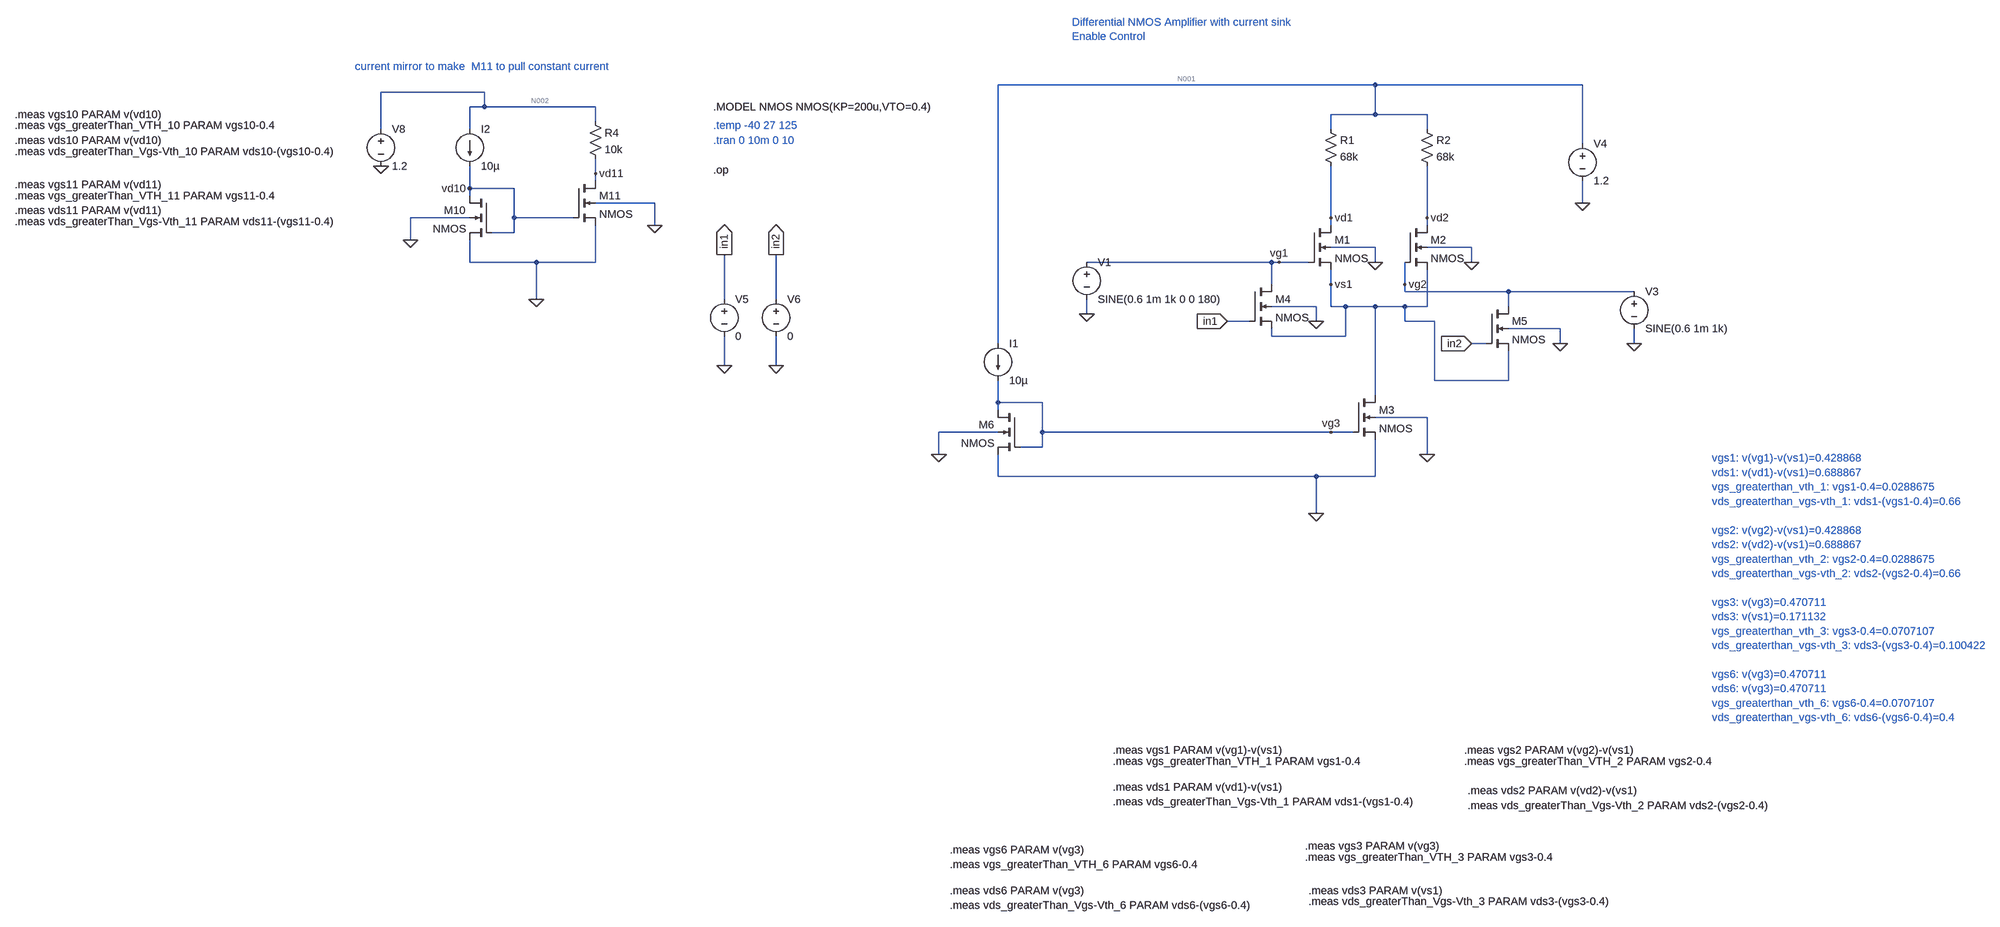
[diagram p0: schematic 4_differential_amplifier_with_current_mirror_without_lambda.asc]
4_differential_amplifier_with_current_mirror_without_lambda.asc, the LTspice schematic file:
Version 4
SHEET 1 1752 1748
WIRE 368 -432 -448 -432
WIRE 816 -432 368 -432
WIRE -1712 -416 -1936 -416
WIRE -1712 -384 -1712 -416
WIRE -1712 -384 -1744 -384
WIRE -1472 -384 -1712 -384
WIRE 368 -368 368 -432
WIRE 368 -368 272 -368
WIRE 480 -368 368 -368
WIRE -1472 -352 -1472 -384
WIRE -1936 -336 -1936 -416
WIRE -1744 -336 -1744 -384
WIRE 272 -336 272 -368
WIRE 480 -336 480 -368
WIRE 816 -304 816 -432
WIRE -1472 -240 -1472 -272
WIRE -1472 -224 -1472 -240
WIRE -1744 -208 -1744 -256
WIRE -1648 -208 -1744 -208
WIRE -1744 -192 -1744 -208
WIRE -1344 -176 -1472 -176
WIRE 816 -176 816 -224
WIRE -1744 -144 -1872 -144
WIRE -1648 -144 -1648 -208
WIRE -1520 -144 -1648 -144
WIRE 272 -144 272 -256
WIRE 480 -144 480 -256
WIRE -1344 -128 -1344 -176
WIRE 272 -128 272 -144
WIRE 480 -128 480 -144
WIRE -1648 -112 -1648 -144
WIRE -1648 -112 -1696 -112
WIRE -1872 -96 -1872 -144
WIRE 368 -80 272 -80
WIRE 576 -80 480 -80
WIRE -1744 -48 -1744 -96
WIRE -1600 -48 -1744 -48
WIRE -1472 -48 -1472 -128
WIRE -1472 -48 -1600 -48
WIRE 144 -48 -256 -48
WIRE 160 -48 144 -48
WIRE 224 -48 160 -48
WIRE 368 -48 368 -80
WIRE 576 -48 576 -80
WIRE 144 0 144 -48
WIRE 272 0 272 -32
WIRE 432 0 432 -48
WIRE 432 16 432 0
WIRE 656 16 432 16
WIRE 928 16 656 16
WIRE -1600 32 -1600 -48
WIRE -1040 32 -1040 -64
WIRE -928 32 -928 -64
WIRE 240 48 144 48
WIRE 272 48 272 0
WIRE 304 48 272 48
WIRE 368 48 304 48
WIRE 432 48 368 48
WIRE 480 48 480 -32
WIRE 480 48 432 48
WIRE 656 48 656 16
WIRE -256 64 -256 32
WIRE 96 80 48 80
WIRE 240 80 240 48
WIRE 432 80 432 48
WIRE 496 80 432 80
WIRE 768 96 656 96
WIRE 144 112 144 96
WIRE 304 112 304 48
WIRE 304 112 144 112
WIRE -448 128 -448 -432
WIRE 608 128 576 128
WIRE 768 128 768 96
WIRE 928 128 928 96
WIRE -1040 176 -1040 112
WIRE -928 176 -928 112
WIRE 496 208 496 80
WIRE 656 208 656 144
WIRE 656 208 496 208
WIRE 368 240 368 48
WIRE -448 256 -448 208
WIRE -352 256 -448 256
WIRE -448 272 -448 256
WIRE 480 288 368 288
WIRE -448 320 -576 320
WIRE -352 320 -352 256
WIRE 272 320 -352 320
WIRE 320 320 272 320
WIRE -352 352 -352 320
WIRE -352 352 -400 352
WIRE -576 368 -576 320
WIRE 480 368 480 288
WIRE -448 416 -448 368
WIRE 240 416 -448 416
WIRE 368 416 368 336
WIRE 368 416 240 416
WIRE 240 496 240 416
FLAG -256 64 0
FLAG 368 -48 0
FLAG 576 -48 0
FLAG 928 128 0
FLAG 816 -176 0
FLAG 160 -48 vg1
FLAG 272 0 vs1
FLAG 272 -144 vd1
FLAG 432 0 vg2
FLAG 480 -144 vd2
FLAG 272 320 vg3
FLAG -1040 176 0
FLAG -928 176 0
FLAG -1040 -64 in1
IOPIN -1040 -64 Out
FLAG -928 -64 in2
IOPIN -928 -64 Out
FLAG 768 128 0
FLAG 240 80 0
FLAG 48 80 in1
IOPIN 48 80 In
FLAG 576 128 in2
IOPIN 576 128 In
FLAG -1872 -96 0
FLAG -1344 -128 0
FLAG -1936 -256 0
FLAG -1600 32 0
FLAG -1744 -208 vd10
FLAG -1472 -240 vd11
FLAG -576 368 0
FLAG 240 496 0
FLAG 480 368 0
SYMBOL nmos4 224 -128 R0
SYMATTR InstName M1
SYMATTR Value2 l=1u w=60u
SYMBOL nmos4 432 -128 R0
SYMATTR InstName M2
SYMATTR Value2 l=1u w=60u
SYMBOL nmos4 320 240 R0
SYMATTR InstName M3
SYMATTR Value2 l=1u w=20u
SYMBOL voltage -256 -64 R0
WINDOW 123 0 0 Left 0
WINDOW 39 0 0 Left 0
SYMATTR InstName V1
SYMATTR Value SINE(0.6 1m 1k 0 0 180)
SYMBOL voltage 928 0 R0
WINDOW 123 0 0 Left 0
WINDOW 39 0 0 Left 0
SYMATTR InstName V3
SYMATTR Value SINE(0.6 1m 1k)
SYMBOL voltage 816 -320 R0
WINDOW 123 0 0 Left 0
WINDOW 39 0 0 Left 0
SYMATTR InstName V4
SYMATTR Value 1.2
SYMBOL res 256 -352 R0
SYMATTR InstName R1
SYMATTR Value 68k
SYMBOL res 464 -352 R0
SYMATTR InstName R2
SYMATTR Value 68k
SYMBOL voltage -1040 16 R0
WINDOW 123 0 0 Left 0
WINDOW 39 0 0 Left 0
SYMATTR InstName V5
SYMATTR Value 0
SYMBOL voltage -928 16 R0
WINDOW 123 0 0 Left 0
WINDOW 39 0 0 Left 0
SYMATTR InstName V6
SYMATTR Value 0
SYMBOL nmos4 96 0 R0
SYMATTR InstName M4
SYMATTR Value2 l=1u w=60u
SYMBOL nmos4 608 48 R0
SYMATTR InstName M5
SYMATTR Value2 l=1u w=60u
SYMBOL current -1744 -336 R0
WINDOW 123 0 0 Left 0
WINDOW 39 0 0 Left 0
SYMATTR InstName I2
SYMATTR Value 10µ
SYMBOL res -1488 -368 R0
SYMATTR InstName R4
SYMATTR Value 10k
SYMBOL nmos4 -1696 -192 M0
SYMATTR InstName M10
SYMATTR Value2 l=1u w=60u
SYMBOL nmos4 -1520 -224 R0
SYMATTR InstName M11
SYMATTR Value2 l=1u w=60u
SYMBOL voltage -1936 -352 R0
WINDOW 123 0 0 Left 0
WINDOW 39 0 0 Left 0
SYMATTR InstName V8
SYMATTR Value 1.2
SYMBOL current -448 128 R0
WINDOW 123 0 0 Left 0
WINDOW 39 0 0 Left 0
SYMATTR InstName I1
SYMATTR Value 10µ
SYMBOL nmos4 -400 272 M0
SYMATTR InstName M6
SYMATTR Value2 l=1u w=20u
TEXT -288 -568 Left 2 ;Differential NMOS Amplifier with current sink\nEnable Control
TEXT -1064 -384 Left 2 !.MODEL NMOS NMOS(KP=200u,VTO=0.4)
TEXT -1064 -312 Left 2 ;.tran 0 10m 0 10
TEXT -200 1008 Left 2 !.meas vgs1 PARAM v(vg1)-v(vs1)
TEXT -200 1088 Left 2 !.meas vds1 PARAM v(vd1)-v(vs1)
TEXT -200 1032 Left 2 !.meas vgs_greaterThan_VTH_1 PARAM vgs1-0.4
TEXT -200 1120 Left 2 !.meas vds_greaterThan_Vgs-Vth_1 PARAM vds1-(vgs1-0.4)
TEXT 560 1008 Left 2 !.meas vgs2 PARAM v(vg2)-v(vs1)
TEXT 568 1096 Left 2 !.meas vds2 PARAM v(vd2)-v(vs1)
TEXT 560 1032 Left 2 !.meas vgs_greaterThan_VTH_2 PARAM vgs2-0.4
TEXT 568 1128 Left 2 !.meas vds_greaterThan_Vgs-Vth_2 PARAM vds2-(vgs2-0.4)
TEXT 216 1216 Left 2 !.meas vgs3 PARAM v(vg3)
TEXT 224 1312 Left 2 !.meas vds3 PARAM v(vs1)
TEXT 216 1240 Left 2 !.meas vgs_greaterThan_VTH_3 PARAM vgs3-0.4
TEXT 224 1336 Left 2 !.meas vds_greaterThan_Vgs-Vth_3 PARAM vds3-(vgs3-0.4)
TEXT -1064 -248 Left 2 !.op
TEXT -1064 -344 Left 2 ;.temp -40 27 125
TEXT -2728 -368 Left 2 !.meas vgs10 PARAM v(vd10)
TEXT -2728 -312 Left 2 !.meas vds10 PARAM v(vd10)
TEXT -2728 -344 Left 2 !.meas vgs_greaterThan_VTH_10 PARAM vgs10-0.4
TEXT -2728 -288 Left 2 !.meas vds_greaterThan_Vgs-Vth_10 PARAM vds10-(vgs10-0.4)
TEXT -2728 -216 Left 2 !.meas vgs11 PARAM v(vd11)
TEXT -2728 -160 Left 2 !.meas vds11 PARAM v(vd11)
TEXT -2728 -192 Left 2 !.meas vgs_greaterThan_VTH_11 PARAM vgs11-0.4
TEXT -2728 -136 Left 2 !.meas vds_greaterThan_Vgs-Vth_11 PARAM vds11-(vgs11-0.4)
TEXT -1992 -472 Left 2 ;current mirror to make  M11 to pull constant current
TEXT -552 1224 Left 2 !.meas vgs6 PARAM v(vg3)
TEXT -552 1312 Left 2 !.meas vds6 PARAM v(vg3)
TEXT -552 1256 Left 2 !.meas vgs_greaterThan_VTH_6 PARAM vgs6-0.4
TEXT -552 1344 Left 2 !.meas vds_greaterThan_Vgs-Vth_6 PARAM vds6-(vgs6-0.4)
TEXT 1096 376 Left 2 ;vgs1: v(vg1)-v(vs1)=0.428868\nvds1: v(vd1)-v(vs1)=0.688867\nvgs_greaterthan_vth_1: vgs1-0.4=0.0288675\nvds_greaterthan_vgs-vth_1: vds1-(vgs1-0.4)=0.66\n \nvgs2: v(vg2)-v(vs1)=0.428868\nvds2: v(vd2)-v(vs1)=0.688867\nvgs_greaterthan_vth_2: vgs2-0.4=0.0288675\nvds_greaterthan_vgs-vth_2: vds2-(vgs2-0.4)=0.66\n \nvgs3: v(vg3)=0.470711\nvds3: v(vs1)=0.171132\nvgs_greaterthan_vth_3: vgs3-0.4=0.0707107\nvds_greaterthan_vgs-vth_3: vds3-(vgs3-0.4)=0.100422\n \nvgs6: v(vg3)=0.470711\nvds6: v(vg3)=0.470711\nvgs_greaterthan_vth_6: vgs6-0.4=0.0707107\nvds_greaterthan_vgs-vth_6: vds6-(vgs6-0.4)=0.4

The netlist it stands for:
* 4_differential_amplifier_with_current_mirror_without_lambda.asc
M1 vd1 vg1 vs1 0 NMOS l=1u w=60u
M2 vd2 vg2 vs1 0 NMOS l=1u w=60u
M3 vs1 vg3 0 0 NMOS l=1u w=20u
V1 vg1 0 SINE(0.6 1m 1k 0 0 180)
V3 vg2 0 SINE(0.6 1m 1k)
V4 N001 0 1.2
R1 N001 vd1 68k
R2 N001 vd2 68k
V5 in1 0 0
V6 in2 0 0
M4 vg1 in1 vs1 0 NMOS l=1u w=60u
M5 vg2 in2 vs1 0 NMOS l=1u w=60u
I2 N002 vd10 10µ
R4 N002 vd11 10k
M10 vd10 vd10 0 0 NMOS l=1u w=60u
M11 vd11 vd10 0 0 NMOS l=1u w=60u
V8 N002 0 1.2
I1 N001 vg3 10µ
M6 vg3 vg3 0 0 NMOS l=1u w=20u
.model NMOS NMOS
.model PMOS PMOS
.lib standard.mos
* Differential NMOS Amplifier with current sink
* Enable Control
.MODEL NMOS NMOS(KP=200u,VTO=0.4)
* .tran 0 10m 0 10
.meas vgs1 PARAM v(vg1)-v(vs1)
.meas vds1 PARAM v(vd1)-v(vs1)
.meas vgs_greaterThan_VTH_1 PARAM vgs1-0.4
.meas vds_greaterThan_Vgs-Vth_1 PARAM vds1-(vgs1-0.4)
.meas vgs2 PARAM v(vg2)-v(vs1)
.meas vds2 PARAM v(vd2)-v(vs1)
.meas vgs_greaterThan_VTH_2 PARAM vgs2-0.4
.meas vds_greaterThan_Vgs-Vth_2 PARAM vds2-(vgs2-0.4)
.meas vgs3 PARAM v(vg3)
.meas vds3 PARAM v(vs1)
.meas vgs_greaterThan_VTH_3 PARAM vgs3-0.4
.meas vds_greaterThan_Vgs-Vth_3 PARAM vds3-(vgs3-0.4)
.op
* .temp -40 27 125
.meas vgs10 PARAM v(vd10)
.meas vds10 PARAM v(vd10)
.meas vgs_greaterThan_VTH_10 PARAM vgs10-0.4
.meas vds_greaterThan_Vgs-Vth_10 PARAM vds10-(vgs10-0.4)
.meas vgs11 PARAM v(vd11)
.meas vds11 PARAM v(vd11)
.meas vgs_greaterThan_VTH_11 PARAM vgs11-0.4
.meas vds_greaterThan_Vgs-Vth_11 PARAM vds11-(vgs11-0.4)
* current mirror to make  M11 to pull constant current
.meas vgs6 PARAM v(vg3)
.meas vds6 PARAM v(vg3)
.meas vgs_greaterThan_VTH_6 PARAM vgs6-0.4
.meas vds_greaterThan_Vgs-Vth_6 PARAM vds6-(vgs6-0.4)
* vgs1: v(vg1)-v(vs1)=0.428868
* vds1: v(vd1)-v(vs1)=0.688867
* vgs_greaterthan_vth_1: vgs1-0.4=0.0288675
* vds_greaterthan_vgs-vth_1: vds1-(vgs1-0.4)=0.66
* vgs2: v(vg2)-v(vs1)=0.428868
* vds2: v(vd2)-v(vs1)=0.688867
* vgs_greaterthan_vth_2: vgs2-0.4=0.0288675
* vds_greaterthan_vgs-vth_2: vds2-(vgs2-0.4)=0.66
* vgs3: v(vg3)=0.470711
* vds3: v(vs1)=0.171132
* vgs_greaterthan_vth_3: vgs3-0.4=0.0707107
* vds_greaterthan_vgs-vth_3: vds3-(vgs3-0.4)=0.100422
* vgs6: v(vg3)=0.470711
* vds6: v(vg3)=0.470711
* vgs_greaterthan_vth_6: vgs6-0.4=0.0707107
* vds_greaterthan_vgs-vth_6: vds6-(vgs6-0.4)=0.4
.backanno
.end

* Results of the author's LTspice run, read from the files saved beside the schematic
* Operating Point:
*   V(vd1) = 860 mV
*   V(vg1) = 600 mV
*   V(vs1) = 171.1 mV
*   V(vd2) = 860 mV
*   V(vg2) = 600 mV
*   V(vg3) = 470.7 mV
*   V(n001) = 1.2 V
*   V(in1) = 0 V
*   V(in2) = 0 V
*   V(n002) = 1.2 V
*   V(vd10) = 440.8 mV
*   V(vd11) = 1.1 V
*   Id(M6) = 10 µA
*   Ig(M6) = 0 A
*   Ib(M6) = -480.7 fA
*   Is(M6) = -10 µA
*   Id(M11) = 10 µA
*   Ig(M11) = 0 A
*   Ib(M11) = -1.11 pA
*   Is(M11) = -10 µA
*   Id(M10) = 10 µA
*   Ig(M10) = 0 A
*   Ib(M10) = -450.8 fA
*   Is(M10) = -10 µA
*   Id(M5) = 1.039 pA
*   Ig(M5) = 0 A
*   Ib(M5) = -791.1 fA
*   Is(M5) = -247.7 fA
*   Id(M4) = 1.039 pA
*   Ig(M4) = 0 A
*   Ib(M4) = -791.1 fA
*   Is(M4) = -247.7 fA
*   Id(M3) = 10 µA
*   Ig(M3) = 0 A
*   Ib(M3) = -181.1 fA
*   Is(M3) = -10 µA
*   Id(M2) = 5 µA
*   Ig(M2) = 0 A
*   Ib(M2) = -1.051 pA
*   Is(M2) = -5 µA
*   Id(M1) = 5 µA
*   Ig(M1) = 0 A
*   Ib(M1) = -1.051 pA
*   Is(M1) = -5 µA
*   I(I1) = 10 µA
*   I(I2) = 10 µA
*   I(R4) = 10 µA
*   I(R2) = 5 µA
*   I(R1) = 5 µA
*   I(V8) = -20 µA
*   I(V6) = 0 A
*   I(V5) = 0 A
*   I(V4) = -20 µA
*   I(V3) = -1.039 pA
*   I(V1) = -1.039 pA
* From the log:
*   Semiconductor Device Operating Points:
*                           --- MOSFET Transistors ---
*   Name:          m6          m11         m10         m5          m4
*   Model:        nmos        nmos        nmos        nmos        nmos
*   Id:          1.00e-05    1.00e-05    1.00e-05    1.04e-12    1.04e-12
*   Vgs:         4.71e-01    4.41e-01    4.41e-01   -1.71e-01   -1.71e-01
*   Vds:         4.71e-01    1.10e+00    4.41e-01    4.29e-01    4.29e-01
*   Vbs:         0.00e+00    0.00e+00    0.00e+00   -1.71e-01   -1.71e-01
*   Vth:         4.00e-01    4.00e-01    4.00e-01    4.00e-01    4.00e-01
*   Vdsat:       7.07e-02    4.08e-02    4.08e-02    0.00e+00    0.00e+00
*   Gm:          2.83e-04    4.90e-04    4.90e-04    0.00e+00    0.00e+00
*   Gds:         0.00e+00    0.00e+00    0.00e+00    0.00e+00    0.00e+00
*   Gmb:         0.00e+00    0.00e+00    0.00e+00    0.00e+00    0.00e+00
*   Cbd:         0.00e+00    0.00e+00    0.00e+00    0.00e+00    0.00e+00
*   Cbs:         0.00e+00    0.00e+00    0.00e+00    0.00e+00    0.00e+00
*   Cgsov:       0.00e+00    0.00e+00    0.00e+00    0.00e+00    0.00e+00
*   Cgdov:       0.00e+00    0.00e+00    0.00e+00    0.00e+00    0.00e+00
*   Cgbov:       0.00e+00    0.00e+00    0.00e+00    0.00e+00    0.00e+00
*   Cgs:         0.00e+00    0.00e+00    0.00e+00    0.00e+00    0.00e+00
*   Cgd:         0.00e+00    0.00e+00    0.00e+00    0.00e+00    0.00e+00
*   Cgb:         0.00e+00    0.00e+00    0.00e+00    0.00e+00    0.00e+00
*   Name:          m3          m2          m1
*   Model:        nmos        nmos        nmos
*   Id:          1.00e-05    5.00e-06    5.00e-06
*   Vgs:         4.71e-01    4.29e-01    4.29e-01
*   Vds:         1.71e-01    6.89e-01    6.89e-01
*   Vbs:         0.00e+00   -1.71e-01   -1.71e-01
*   Vth:         4.00e-01    4.00e-01    4.00e-01
*   Vdsat:       7.07e-02    2.89e-02    2.89e-02
*   Gm:          2.83e-04    3.46e-04    3.46e-04
*   Gds:         0.00e+00    0.00e+00    0.00e+00
*   Gmb:         0.00e+00    0.00e+00    0.00e+00
*   Cbd:         0.00e+00    0.00e+00    0.00e+00
*   Cbs:         0.00e+00    0.00e+00    0.00e+00
*   Cgsov:       0.00e+00    0.00e+00    0.00e+00
*   Cgdov:       0.00e+00    0.00e+00    0.00e+00
*   Cgbov:       0.00e+00    0.00e+00    0.00e+00
*   Cgs:         0.00e+00    0.00e+00    0.00e+00
*   Cgd:         0.00e+00    0.00e+00    0.00e+00
*   Cgb:         0.00e+00    0.00e+00    0.00e+00
*   vgs1: v(vg1)-v(vs1)=0.428868
*   vds1: v(vd1)-v(vs1)=0.688867
*   vgs_greaterthan_vth_1: vgs1-0.4=0.0288675
*   vds_greaterthan_vgs-vth_1: vds1-(vgs1-0.4)=0.66
*   vgs2: v(vg2)-v(vs1)=0.428868
*   vds2: v(vd2)-v(vs1)=0.688867
*   vgs_greaterthan_vth_2: vgs2-0.4=0.0288675
*   vds_greaterthan_vgs-vth_2: vds2-(vgs2-0.4)=0.66
*   vgs3: v(vg3)=0.470711
*   vds3: v(vs1)=0.171132
*   vgs_greaterthan_vth_3: vgs3-0.4=0.0707107
*   vds_greaterthan_vgs-vth_3: vds3-(vgs3-0.4)=0.100422
*   vgs10: v(vd10)=0.440825
*   vds10: v(vd10)=0.440825
*   vgs_greaterthan_vth_10: vgs10-0.4=0.0408248
*   vds_greaterthan_vgs-vth_10: vds10-(vgs10-0.4)=0.4
*   vgs11: v(vd11)=1.1
*   vds11: v(vd11)=1.1
*   vgs_greaterthan_vth_11: vgs11-0.4=0.7
*   vds_greaterthan_vgs-vth_11: vds11-(vgs11-0.4)=0.4
*   vgs6: v(vg3)=0.470711
*   vds6: v(vg3)=0.470711
*   vgs_greaterthan_vth_6: vgs6-0.4=0.0707107
*   vds_greaterthan_vgs-vth_6: vds6-(vgs6-0.4)=0.4